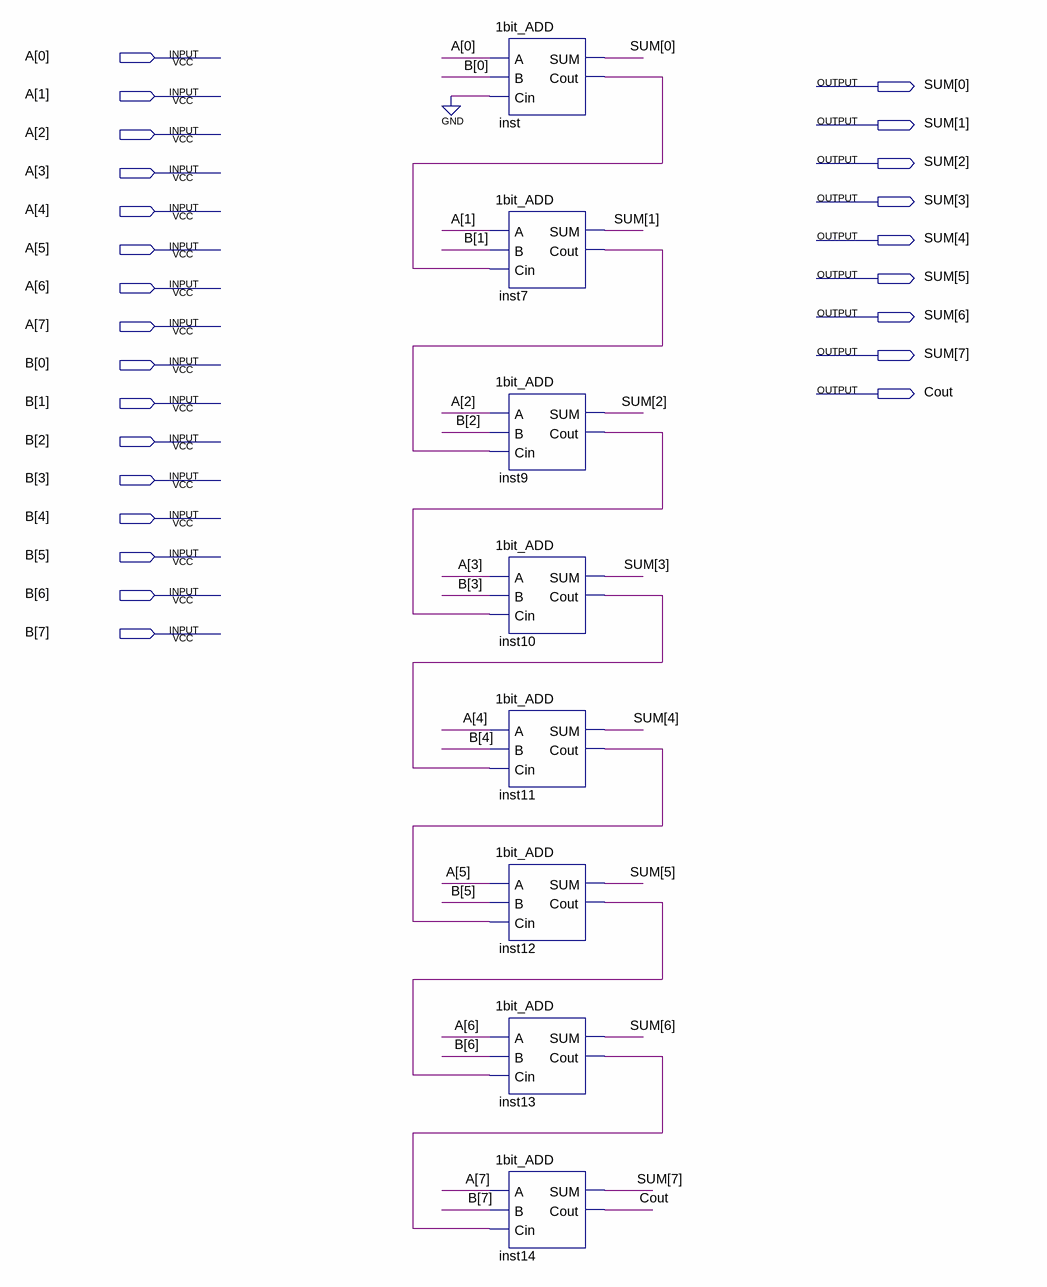
[diagram p0: schematic sheet]
// Quartus schematic g08_adder.bdf as structural Verilog: 8 symbols, 25 pins
module g08_adder (
  input  [7:0] A,
  input  [7:0] B,
  output [7:0] SUM,
  output Cout
);

  wire inst7_cout, inst9_cout, inst10_cout, inst11_cout, inst12_cout, inst13_cout, inst_cout;

  \1bit_ADD  inst (.A(A[0]), .B(B[0]), .Cin(1'b0), .SUM(SUM[0]), .Cout(inst_cout));
  \1bit_ADD  inst7 (.A(A[1]), .B(B[1]), .Cin(inst_cout), .SUM(SUM[1]), .Cout(inst7_cout));
  \1bit_ADD  inst9 (.A(A[2]), .B(B[2]), .Cin(inst7_cout), .SUM(SUM[2]), .Cout(inst9_cout));
  \1bit_ADD  inst10 (.A(A[3]), .B(B[3]), .Cin(inst9_cout), .SUM(SUM[3]), .Cout(inst10_cout));
  \1bit_ADD  inst11 (.A(A[4]), .B(B[4]), .Cin(inst10_cout), .SUM(SUM[4]), .Cout(inst11_cout));
  \1bit_ADD  inst12 (.A(A[5]), .B(B[5]), .Cin(inst11_cout), .SUM(SUM[5]), .Cout(inst12_cout));
  \1bit_ADD  inst13 (.A(A[6]), .B(B[6]), .Cin(inst12_cout), .SUM(SUM[6]), .Cout(inst13_cout));
  \1bit_ADD  inst14 (.A(A[7]), .B(B[7]), .Cin(inst13_cout), .SUM(SUM[7]), .Cout(Cout));
endmodule
